# Altium schematic sheet WRSHG_V1.1.SchDoc
size A4
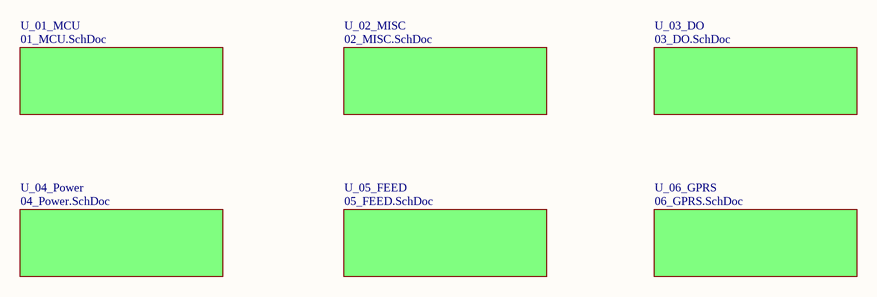
[diagram p0: WRSHG_V1.1.SchDoc]

## Sub-sheets
U_01_MCU = 01_MCU.SchDoc: no entries
U_02_MISC = 02_MISC.SchDoc: no entries
U_03_DO = 03_DO.SchDoc: no entries
U_04_Power = 04_Power.SchDoc: no entries
U_05_FEED = 05_FEED.SchDoc: no entries
U_06_GPRS = 06_GPRS.SchDoc: no entries